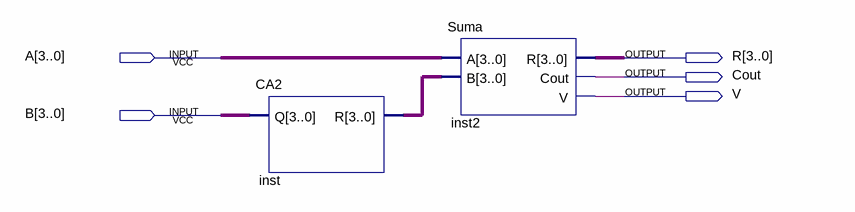
[diagram p0: schematic sheet]
// Quartus schematic Resta.bdf as structural Verilog: 2 symbols, 5 pins
module Resta (
  input  [3:0] A,
  input  [3:0] B,
  output [3:0] R,
  output Cout,
  output V
);

  wire [3:0] inst_r;

  CA2 inst (.Q(B), .R(inst_r));
  Suma inst2 (.A(A), .B(inst_r), .R(R), .Cout(Cout), .V(V));
endmodule
